# EAGLE schematic SFT_MotorController1.2v (EAGLE 7.5.0)
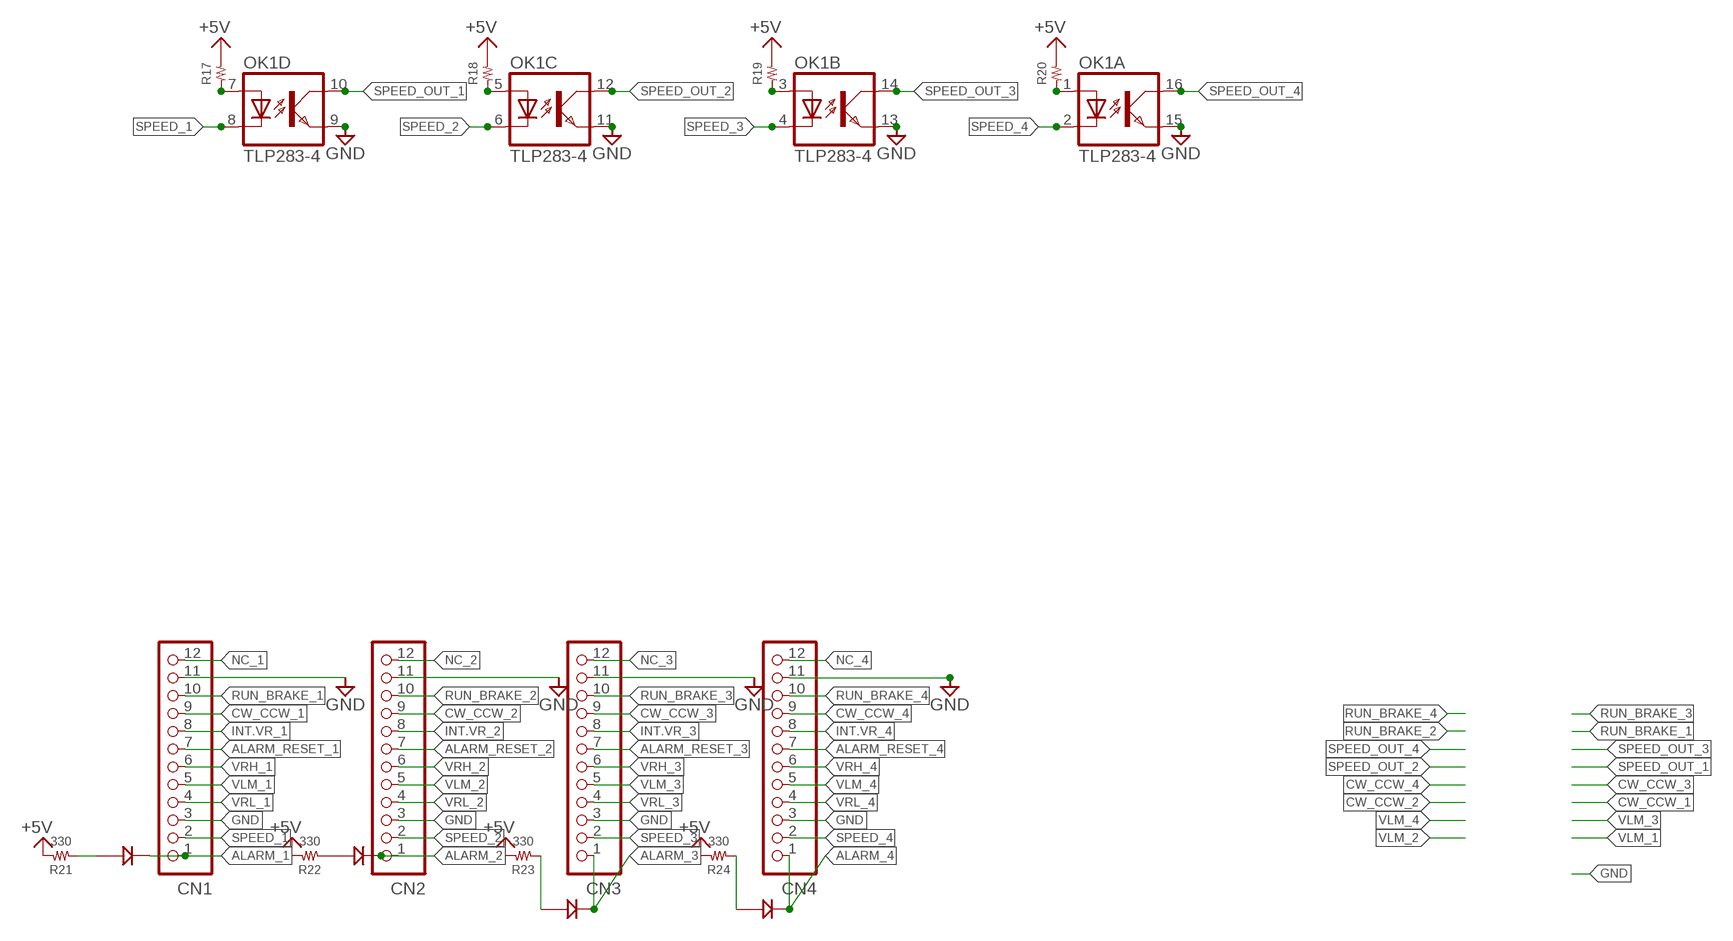
[diagram p0: schematic, sheet 1, part 1 of 2]
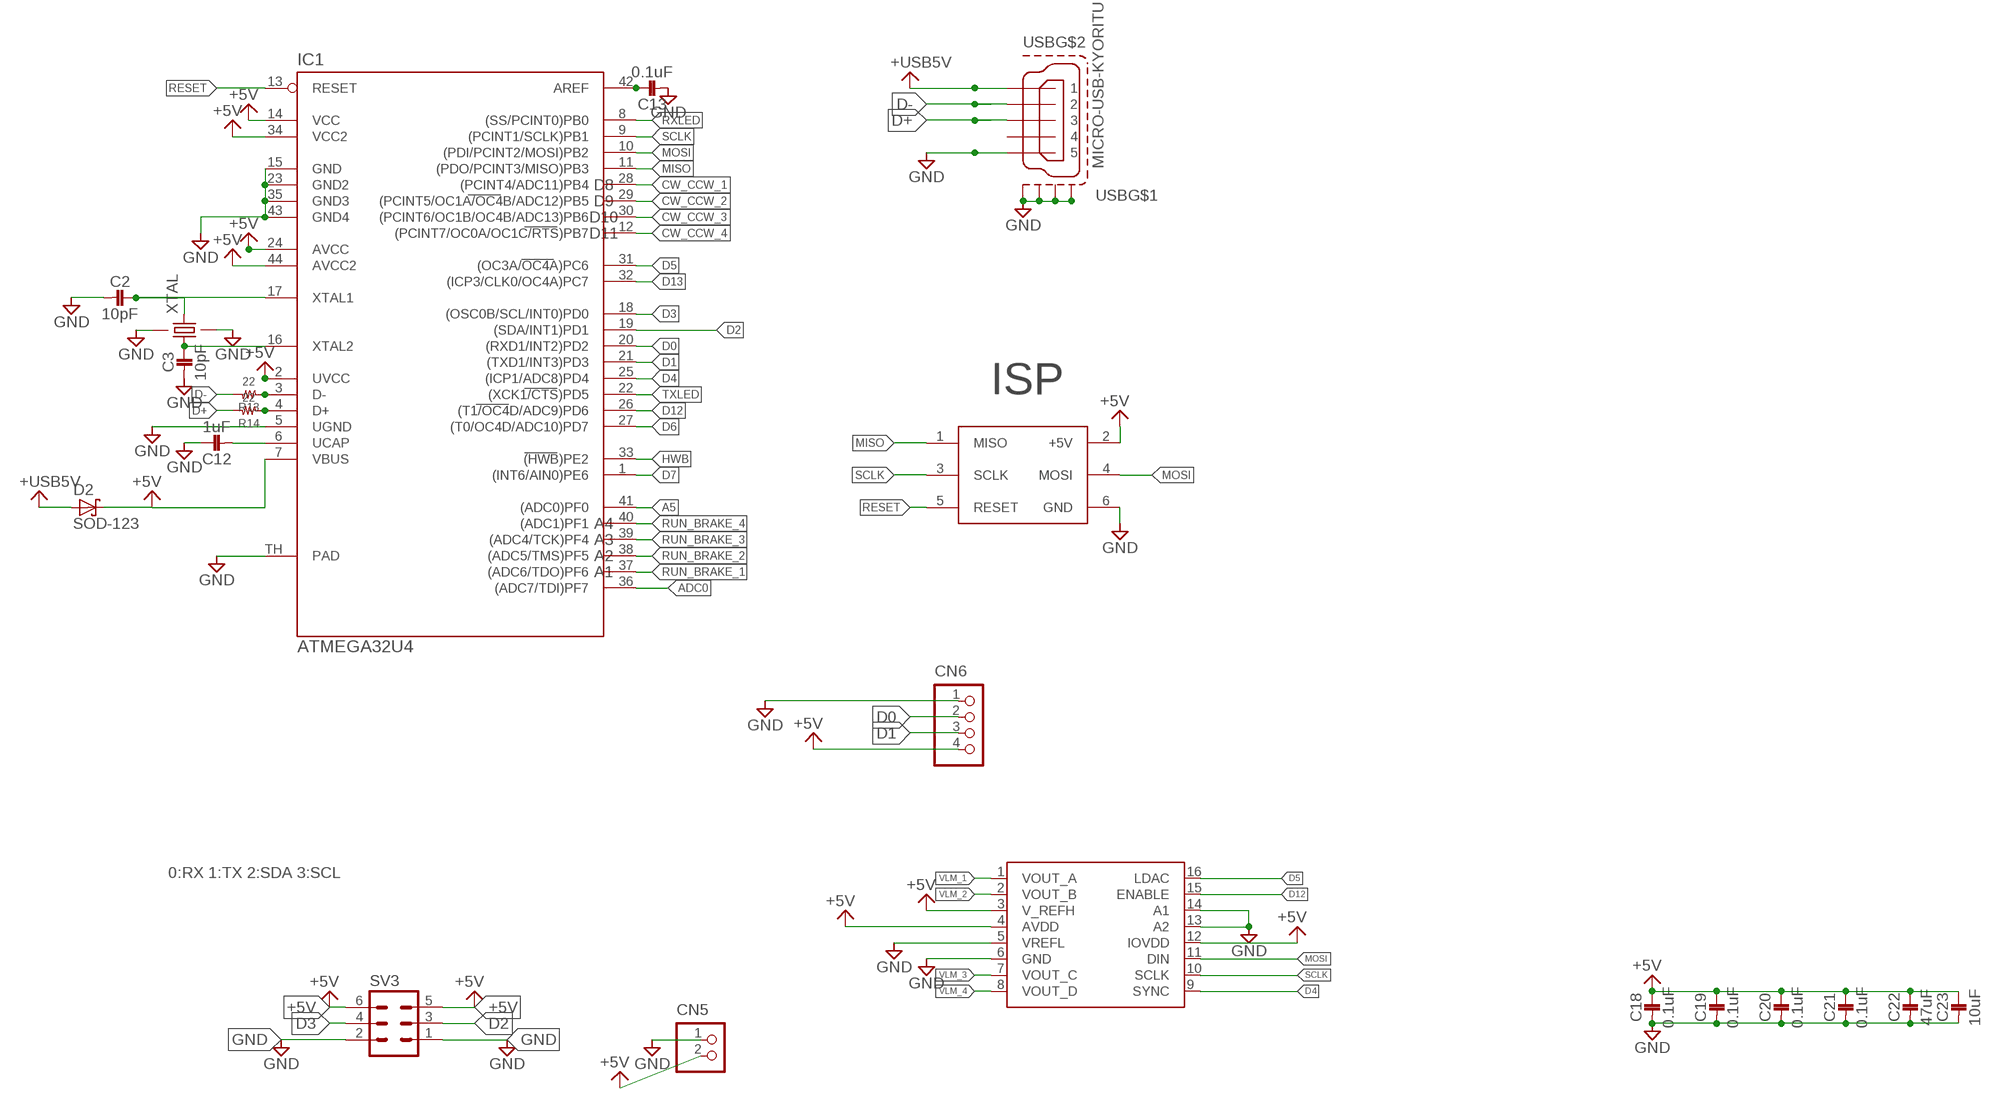
[diagram p1: schematic, sheet 1, part 2 of 2]

## Parts
C2  10pF  1005  [1005]
C3  10pF  1005  [1005]
C12  1uF  1005  [1005]
C13  0.1uF  1005  [1005]
C18  0.1uF  1005  [1005]
C19  0.1uF  1005  [1005]
C20  0.1uF  1005  [1005]
C21  0.1uF  1005  [1005]
C22  47uF  1608  [1608]
C23  10uF  1608  [1608]
CN1  B12B-XASK-1  [B12B-XASK-1]
CN2  B12B-XASK-1  [B12B-XASK-1]
CN3  B12B-XASK-1  [B12B-XASK-1]
CN4  B12B-XASK-1  [B12B-XASK-1]
CN5  B2B-XASK-1  [B2B-XASK-1]
CN6  B4B-XASK-1  [B4B-XASK-1]
D2  SOD-123  [SOD_123]
IC1  ATMEGA32U4  [QFN-44-7X7]
IC3  DAC7564  [TSSOP16]
OK1  TLP283-4  [MINI-FLAT-16]
R13  22  RESISTOR_1005  [1005]
R14  22  RESISTOR_1005  [1005]
R17  RESISTOR__SMD  [1608]
R18  RESISTOR__SMD  [1608]
R19  RESISTOR__SMD  [1608]
R20  RESISTOR__SMD  [1608]
R21  330  RESISTOR__SMD  [1608]
R22  330  RESISTOR__SMD  [1608]
R23  330  RESISTOR__SMD  [1608]
R24  330  RESISTOR__SMD  [1608]
SV3  ML6  [ML6]
U$8  ICSP  [ICSP]
U$36  3MMLED  [3MM]
U$37  3MMLED  [3MM]
U$38  3MMLED  [3MM]
U$39  3MMLED  [3MM]
USB  MICRO-USB-KYORITU  [ZX62R-B-5P]
XTAL  FA-238  [FA-238]

## Nets
+5V: C18.1 C19.1 C20.1 C21.1 C22.P$1 C23.P$1 CN5.2 CN6.4 D2.C IC1.2(UVCC) IC1.7(VBUS) IC1.14(VCC) IC1.24(AVCC) IC1.34(VCC2) IC1.44(AVCC2) IC3.3(V_REFH) IC3.4(AVDD) IC3.12(IOVDD) R17.2 R18.2 R19.2 R20.2 R21.2 R22.2 R23.2 R24.2 SV3.5 SV3.6 U$8.2(+5V)
+USB5V: D2.A USB.5
A5: IC1.41((ADC0)PF0)
ADC0: IC1.36((ADC7/TDI)PF7)
ALARM_1: CN1.1 U$37.K
ALARM_2: CN2.1 U$38.K
ALARM_3: CN3.1 U$36.K
ALARM_4: CN4.1 U$39.K
ALARM_RESET_1: CN1.7
ALARM_RESET_2: CN2.7
ALARM_RESET_3: CN3.7
ALARM_RESET_4: CN4.7
CW_CCW_1: CN1.9 IC1.28((PCINT4/ADC11)PB4)
CW_CCW_2: CN2.9 IC1.29((PCINT5/OC1A/OC4B/ADC12)PB5)
CW_CCW_3: CN3.9 IC1.30((PCINT6/OC1B/OC4B/ADC13)PB6)
CW_CCW_4: CN4.9 IC1.12((PCINT7/OC0A/OC1C/RTS)PB7)
D0: CN6.2 IC1.20((RXD1/INT2)PD2)
D1: CN6.3 IC1.21((TXD1/INT3)PD3)
D2: IC1.19((SDA/INT1)PD1) SV3.3
D3: IC1.18((OSC0B/SCL/INT0)PD0) SV3.4
D4: IC1.25((ICP1/ADC8)PD4) IC3.9(SYNC)
D5: IC1.31((OC3A/OC4A)PC6) IC3.16(LDAC)
D6: IC1.27((T0/OC4D/ADC10)PD7)
D7: IC1.1((INT6/AIN0)PE6)
D12: IC1.26((T1/OC4D/ADC9)PD6) IC3.15(ENABLE)
D13: IC1.32((ICP3/CLK0/OC4A)PC7)
D+: R14.2 USB.3
D-: R13.2 USB.4
GND: C2.2 C3.2 C12.1 C13.2 C18.2 C19.2 C20.2 C21.2 C22.P$2 C23.P$2 CN1.3 CN1.11 CN2.3 CN2.11 CN3.3 CN3.11 CN4.3 CN4.11 CN5.1 CN6.1 IC1.5(UGND) IC1.15(GND) IC1.23(GND2) IC1.35(GND3) IC1.43(GND4) IC1.TH(PAD) IC3.5(VREFL) IC3.6(GND) IC3.13(A2) IC3.14(A1) OK1.9(D:EMIT) OK1.11(C:EMIT) OK1.13(B:EMIT) OK1.15(A:EMIT) SV3.1 SV3.2 U$8.6(GND) USB.1 USB.M1(S1) USB.M2(S2) USB.M3(S3) USB.M4(S4) XTAL.2 XTAL.4
HWB: IC1.33((HWB)PE2)
INT.VR_1: CN1.8
INT.VR_2: CN2.8
INT.VR_3: CN3.8
INT.VR_4: CN4.8
MISO: IC1.11((PDO/PCINT3/MISO)PB3) U$8.1(MISO)
MOSI: IC1.10((PDI/PCINT2/MOSI)PB2) IC3.11(DIN) U$8.4(MOSI)
N$1: IC1.3(D-) R13.1
N$2: IC1.4(D+) R14.1
N$3: C3.1 IC1.16(XTAL2) XTAL.1
N$4: R22.1 U$38.A
N$5: OK1.3(B:A) R19.1
N$6: OK1.5(C:A) R18.1
N$7: OK1.7(D:A) R17.1
N$8: OK1.1(A:A) R20.1
N$9: C13.1 IC1.42(AREF)
N$10: C2.1 IC1.17(XTAL1) XTAL.3
N$13: R21.1 U$37.A
N$15: R23.1 U$36.A
N$16: R24.1 U$39.A
N$18: C12.2 IC1.6(UCAP)
NC_1: CN1.12
NC_2: CN2.12
NC_3: CN3.12
NC_4: CN4.12
RESET: IC1.13(RESET) U$8.5(RESET)
RUN_BRAKE_1: CN1.10 IC1.37((ADC6/TDO)PF6)
RUN_BRAKE_2: CN2.10 IC1.38((ADC5/TMS)PF5)
RUN_BRAKE_3: CN3.10 IC1.39((ADC4/TCK)PF4)
RUN_BRAKE_4: CN4.10 IC1.40((ADC1)PF1)
RXLED: IC1.8((SS/PCINT0)PB0)
SCLK: IC1.9((PCINT1/SCLK)PB1) IC3.10(SCLK) U$8.3(SCLK)
SPEED_1: CN1.2 OK1.8(D:C)
SPEED_2: CN2.2 OK1.6(C:C)
SPEED_3: CN3.2 OK1.4(B:C)
SPEED_4: CN4.2 OK1.2(A:C)
SPEED_OUT_1: OK1.10(D:COL)
SPEED_OUT_2: OK1.12(C:COL)
SPEED_OUT_3: OK1.14(B:COL)
SPEED_OUT_4: OK1.16(A:COL)
TXLED: IC1.22((XCK1/CTS)PD5)
VLM_1: CN1.5 IC3.1(VOUT_A)
VLM_2: CN2.5 IC3.2(VOUT_B)
VLM_3: CN3.5 IC3.7(VOUT_C)
VLM_4: CN4.5 IC3.8(VOUT_D)
VRH_1: CN1.6
VRH_2: CN2.6
VRH_3: CN3.6
VRH_4: CN4.6
VRL_1: CN1.4
VRL_2: CN2.4
VRL_3: CN3.4
VRL_4: CN4.4
Unconnected: USB.2

## Notes on the sheet
- D8
- D9
- D10
- D11
- ISP
- A4
- A3
- A2
- A1
- 0:RX 1:TX 2:SDA 3:SCL

## Library data of the parts
C2 C3 C12 C13 C18-C21 = 02_C:1005
C22 C23 = 02_C:1608
CN1-CN4 = jst-xa:B12B-XASK-1: Wire-to-Board 2.5mm pitch top mount connector Source: http://www.jst-mfg.com/product/pdf/jpn/XA1.pdf http://www.jst-mfg.com/product/detail.php?series=272
CN5 = jst-xa:B2B-XASK-1: Wire-to-Board 2.5mm pitch top mount connector Source: http://www.jst-mfg.com/product/pdf/jpn/XA1.pdf http://www.jst-mfg.com/product/detail.php?series=272
CN6 = jst-xa:B4B-XASK-1: Wire-to-Board 2.5mm pitch top mount connector Source: http://www.jst-mfg.com/product/pdf/jpn/XA1.pdf http://www.jst-mfg.com/product/detail.php?series=272
D2 = 15_DIODE:SOD-123
IC1 = 04_IC:ATMEGA32U4
IC3 = 04_IC:DAC7564
OK1 = optocoupler:TLP283-4: TOSHIBA PHOTOCOUPLER GaAs IRED & PHOTO-TRANSISTOR Source: http://www.semicon.toshiba.co.jp/td/en/Opto/Photocoupler/en_20050928_TLP283_datasheet.pdf; OC_FARNELL: unknown; OC_NEWARK: unknown
R13 R14 = 01_R:RESISTOR_1005
R17-R24 = 01_R:RESISTOR__SMD
SV3 = con-ml:ML6: HARTING; OC_FARNELL: unknown; OC_NEWARK: unknown
U$8 = 08_CONECTOR:ICSP
U$36-U$39 = 10_LED:3MMLED
USB = con-hirose1:MICRO-USB-KYORITU
XTAL = 09_2_CRYSTAL:FA-238